# EAGLE design Enclosure 130x95 BPM-R (EAGLE 9.6.2)
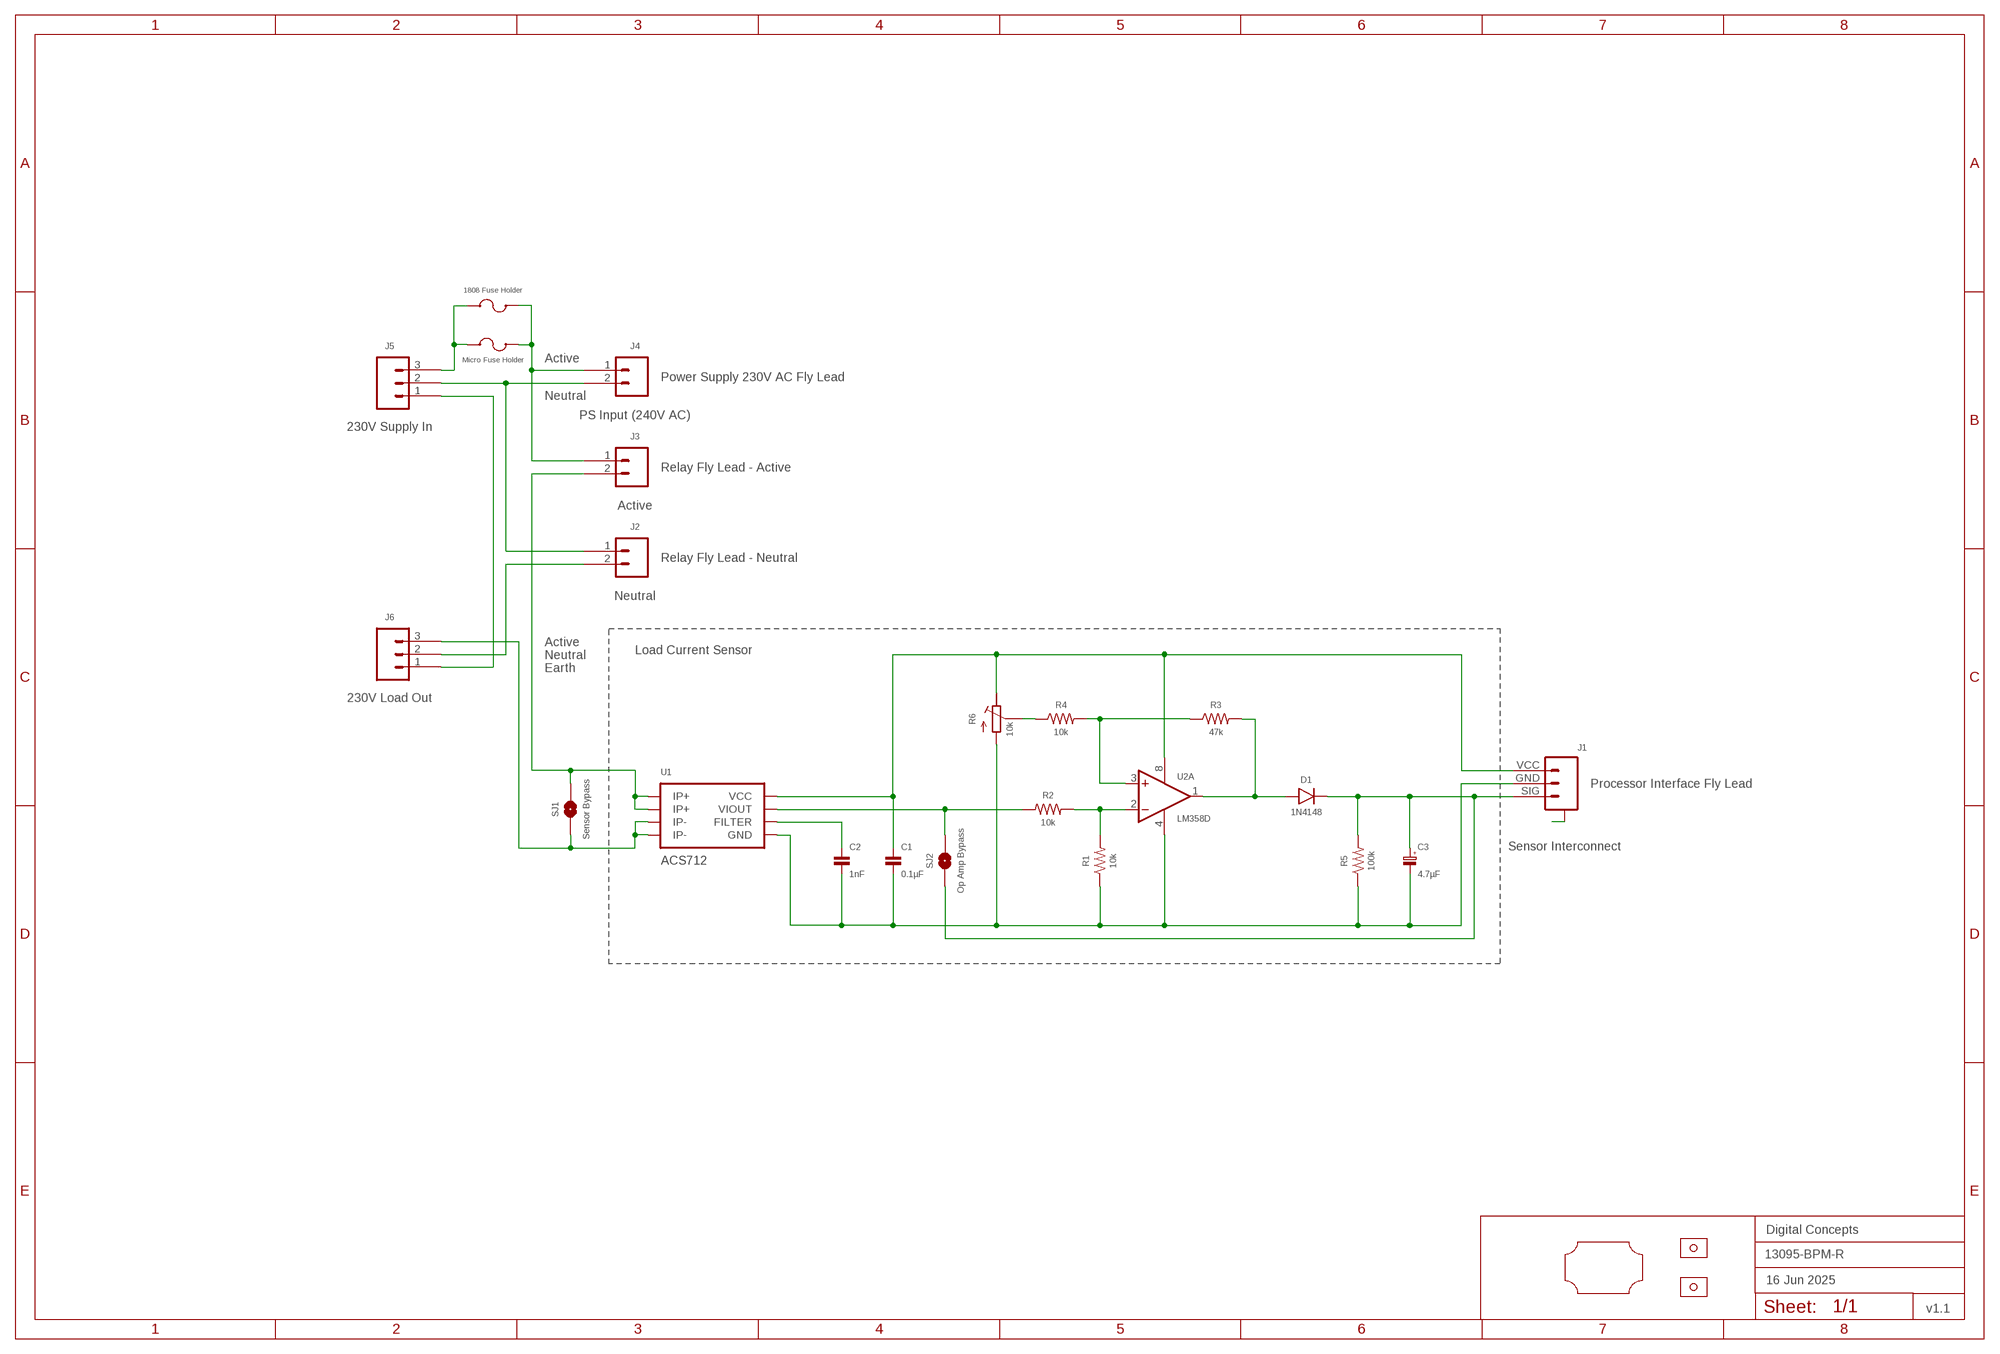
[diagram p0: schematic, sheet 1]
FRAME2 (A3L-LOC): DATE: 16 Jun 2025; OWNER: Digital Concepts; TITLE: 13095-BPM-R; VERSION: v1.1

## Parts
C1  0.1µF  CAPACITOR-0805  [C0805]
C2  1nF  CAPACITOR-0805  [C0805]
C3  4.7µF  CAPACITOR-1206-TANTALUM  [C1206-POLARISED]
D1  1N4148  DIODE-1N4148-SOD323  [SOD-323]
F2  1808 Fuse Holder  FUSE-HOLDER-1808  [FUSE-HOLDER-1808]
J1  Sensor Interconnect  JST-SH1.0-3-SMD-HORIZONTAL-SIG  [JST-SH1.0-3-HORIZONTAL-SIG]
J2  Neutral  TERMINAL_SCREW_2P_VERTICAL  [TERMINAL-SCREW-2P]
J3  Active  TERMINAL_SCREW_2P_VERTICAL  [TERMINAL-SCREW-2P]
J4  PS Input (240V AC)  JST-XH2.54-2-HORIZONTAL  [JST-XH2.4-2-HORIZONTAL]
J5  230V Supply In  TERMINAL_SCREW_3P_VERTICAL  [TERMINAL-SCREW-3P]
J6  230V Load Out  TERMINAL_SCREW_3P_VERTICAL  [TERMINAL-SCREW-3P]
R1  10k  RESISTORR0805  [R0805]
R2  10k  RESISTORR0805  [R0805]
R3  47k  RESISTORR0805  [R0805]
R4  10k  RESISTORR0805  [R0805]
R5  100k  RESISTORR0805  [R0805]
R6  10k  RESISTOR-TRIMM-3386P  [RTRIM3386P]
SJ1  Sensor Bypass  SJ  [SJ]
SJ2  Op Amp Bypass  SJ  [SJ]
U1  ACS712  [SOP-8]
U2  LM358D  [SOP-8]
U$1  PCB-OUTLINE-130X95-MAX-RC-H3  [PROTO-130X95-OUTLINE-MAX-RC-H3]
U$2  Micro Fuse Holder  FUSE-HOLDER  [FUSE-HOLDER-MICRO]
U$4  STRAIN-RELIEF-SADDLE  [STRAIN-RELIEF-SADDLE]
U$5  STRAIN-RELIEF-SADDLE  [STRAIN-RELIEF-SADDLE]

## Nets
A: J1.A@1(A) J1.A@3(A)
ACTIVE_IN: F2.P$2 J3.1 J4.1 U$2.P$3 U$2.P$4
ACTIVE_OUT: J3.2 SJ1.2 U1.1(IP+) U1.2(IP+)
EARTH: J5.1 J6.1
N$2: C1.1 J1.VCC R6.1(E) U1.8(VCC) U2.8(P:V+)
N$3: C3.1(+) D1.C J1.SIG R5.2 SJ2.1
N$4: D1.A R3.2 U2.1(A:OUT)
N$5: R3.1 R4.2 U2.3(A:+IN)
N$6: R4.1 R6.2(S)
N$7: F2.P$1 J5.3 U$2.P$1 U$2.P$2
N$8: R1.2 R2.2 U2.2(A:-IN)
N$19: J6.3 SJ1.1 U1.3(IP-) U1.4(IP-)
N$20: C1.2 C2.2 C3.2(-) J1.GND R1.1 R5.1 R6.3(A) U1.5(GND) U2.4(P:V-)
N$22: R2.1 SJ2.2 U1.7(VIOUT)
N$24: C2.1 U1.6(FILTER)
NEUTRAL_IN: J2.1 J4.2 J5.2
NEUTRAL_OUT: J2.2 J6.2
Unconnected: U2.5(B:+IN) U2.6(B:-IN) U2.7(B:OUT)

## Notes on the sheet
- Active
- Power Supply 230V AC Fly Lead
- Neutral
- Relay Fly Lead - Active
- Relay Fly Lead - Neutral
- Active
- Neutral | Load Current Sensor
- Earth
- Processor Interface Fly Lead

## Library data of the parts
C1 C2 = digitalconcepts:CAPACITOR-0805: 0805 Capacitor
C3 = digitalconcepts:CAPACITOR-1206-TANTALUM: Capacitor 1206 Tantalum
D1 = digitalconcepts:DIODE-1N4148-SOD323: 1N4148 SOD-323
F2 = digitalconcepts:FUSE-HOLDER-1808: 1808 Fuse Holder
J1 = digitalconcepts:JST-SH1.0-3-SMD-HORIZONTAL-SIG: JST SH1.0 3P SMD Horizontal Connector with Signal
J2 J3 = digitalconcepts:TERMINAL_SCREW_2P_VERTICAL: PCB Mount Screw-Type Terminal 2P
J4 = digitalconcepts:JST-XH2.54-2-HORIZONTAL: XH2.54 2P Horizontal Connector
J5 J6 = digitalconcepts:TERMINAL_SCREW_3P_VERTICAL: PCB Mount Screw-Type Terminal 3P
R1-R5 = digitalconcepts:RESISTOR: Resistor; SPICEPREFIX: R
R6 = digitalconcepts:RESISTOR-TRIMM-3386P: BOURNS Trim Pot 3386P
SJ1 SJ2 = digitalconcepts:SJ: Solder Jumper
U1 = digitalconcepts:ACS712: ACS712 Hall-Effect-Based Linear Current Sensor IC
U2 = digitalconcepts:LM358: OP AMP also LM158; LM258; LM2904 Source: http://cache.national.com/ds/LM/LM158.pdf
U$1 = digitalconcepts:PCB-OUTLINE-130X95-MAX-RC-H3: PCB Eagle Max-Right-Cropped outline for 130 x 95 enclosure (Horizontal format)
U$2 = digitalconcepts:FUSE-HOLDER: Fuse Holder
U$4 U$5 = digitalconcepts:STRAIN-RELIEF-SADDLE: Strain Relief Saddle (7mm x 13mm)

## Board
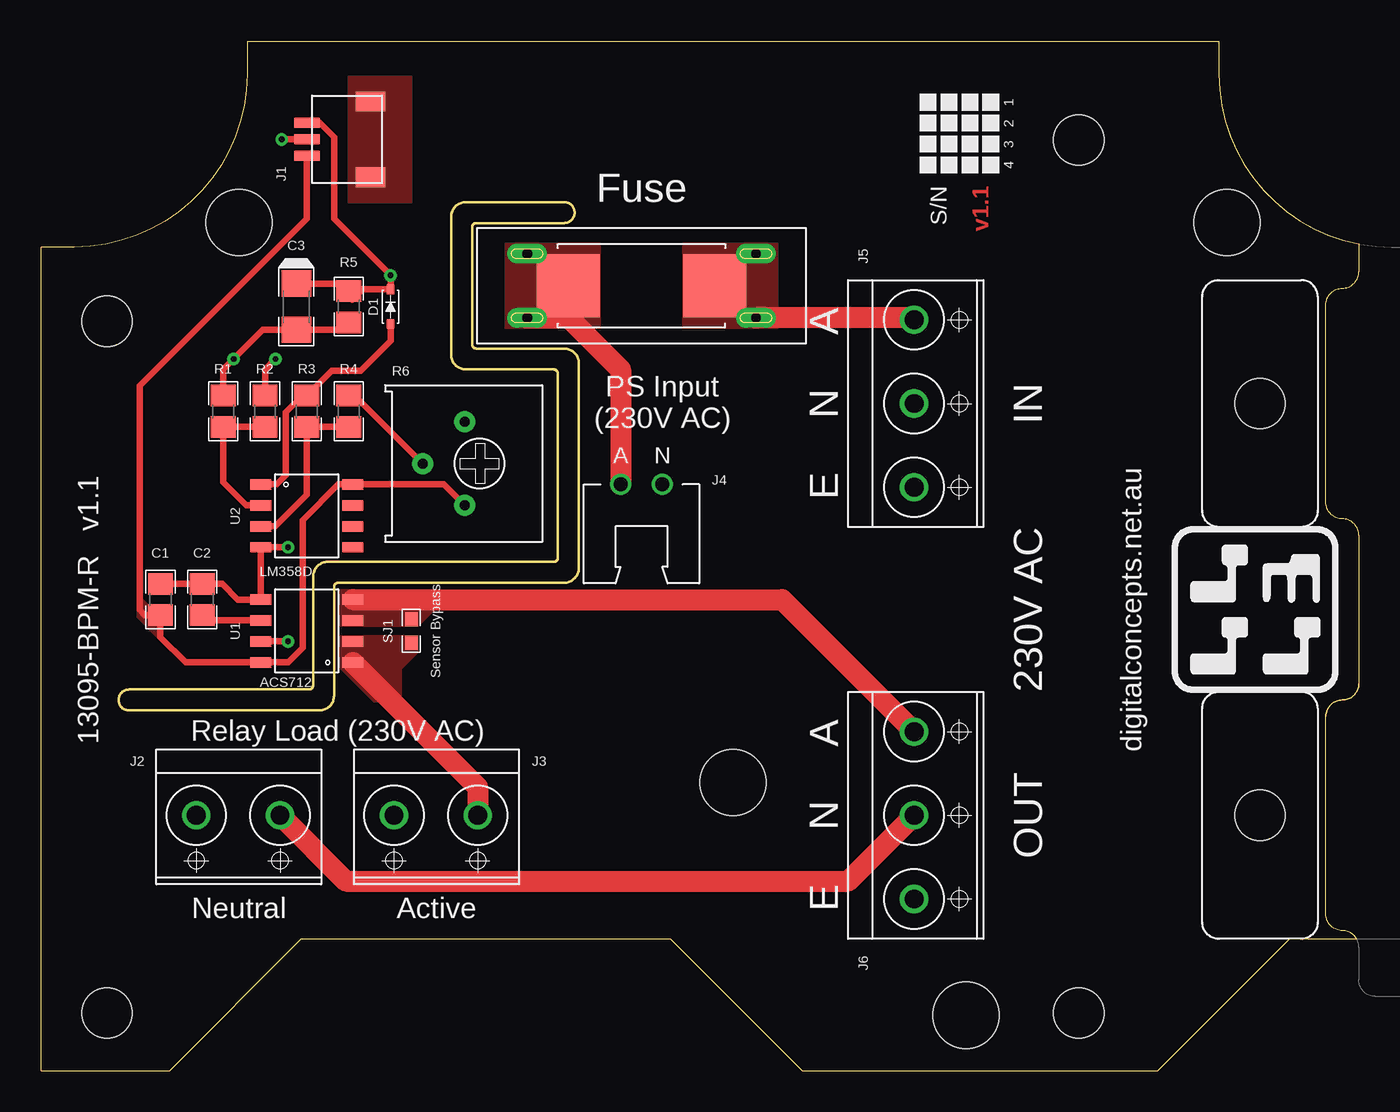
[diagram p1: board, top side]
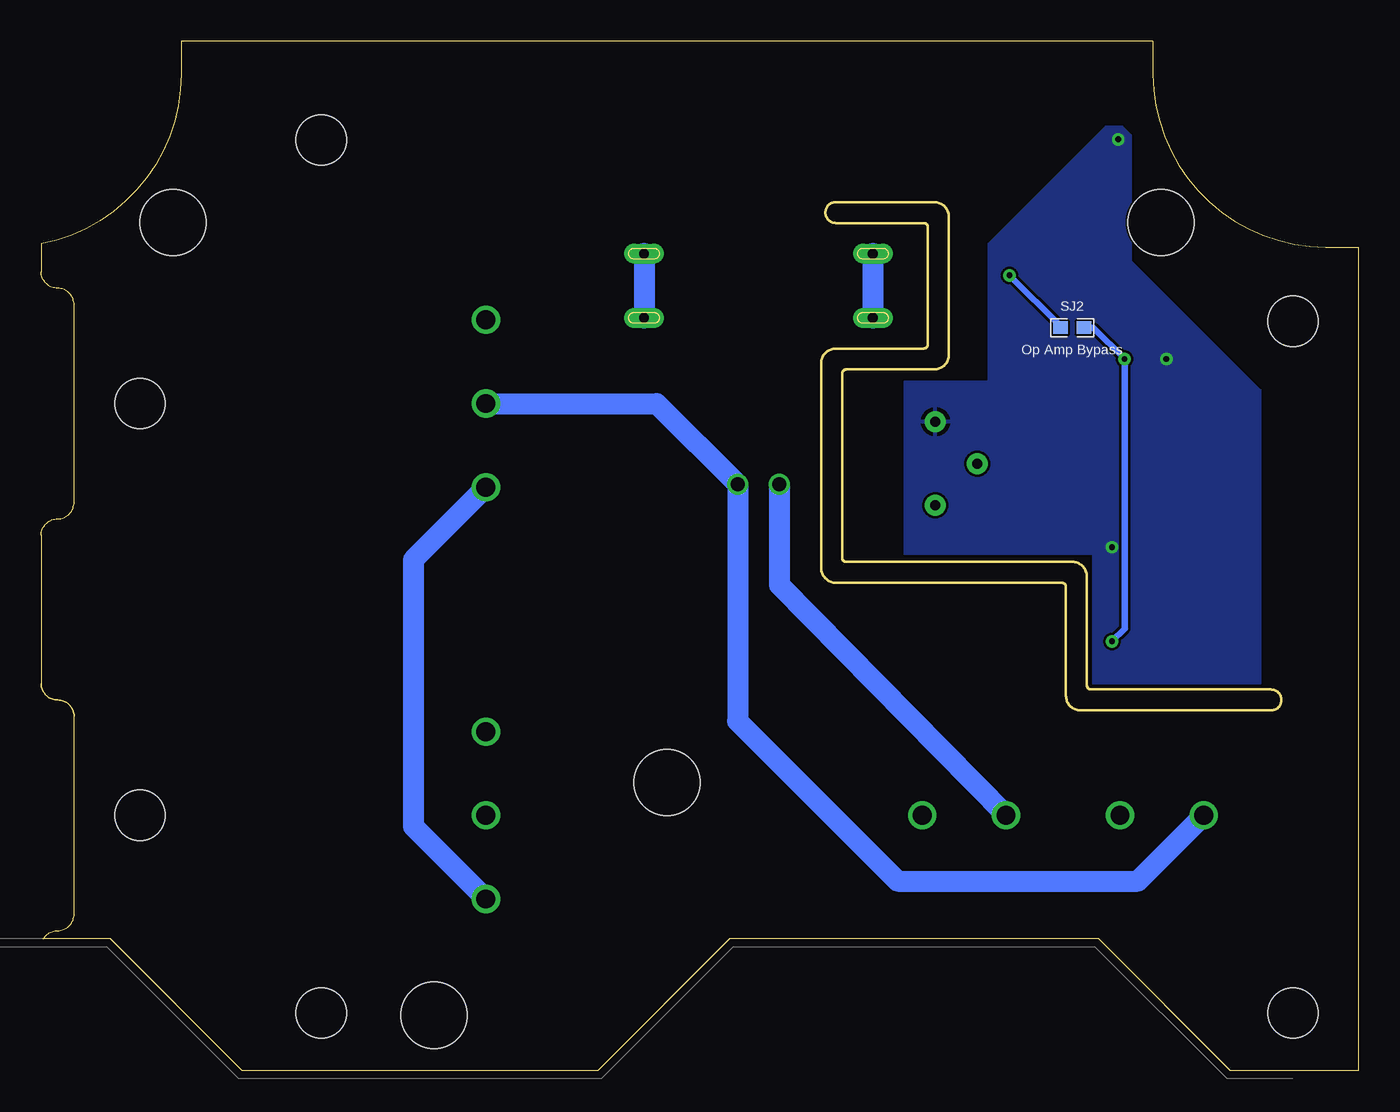
[diagram p2: board, bottom side, seen from below]

Size 80 x 62.5 mm. Coordinates in mm from the lower left corner, seen from the top.
Copper layers (1*16): Top 0.035mm / dielectric 1.5mm / Bottom 0.035mm
Design rules "default *": minimum track width 6mil, minimum drill 0.35mm, track to track 6mil, track to pad 6mil, pad to pad 6mil, via to via 6mil, smd to smd 6mil, copper to edge 6mil, drill to drill 6mil, minimum pad ring 1mil, minimum via ring 8mil, stop-mask expansion 4mil, vias tented up to drill 0mil, thermal gap 10mil
Milling: 28 lines

### Footprints (pad centres in the part's own frame; a part is rotated, then mirrored left to right if it is on the bottom)
C0805 = smd 1.3 x 1.5: 1 -0.95,0; 2 0.95,0
C1206-POLARISED = smd 1.6 x 1.8: 1 -1.4,0; 2 1.4,0
SOD-323 = smd 0.59 x 0.45: A -1.055,0; C 1.055,0
FUSE-HOLDER-1808 = smd 3.81 x 3.81: P$1 -4.445,0; P$2 4.445,0
JST-SH1.0-3-HORIZONTAL-SIG = smd 1.2 x 1.8: A@1 -2.3,-1.335; A@3 2.3,-1.335 | smd 0.6 x 1.55: GND 0,2.54; SIG 1,2.54; VCC -1,2.54
TERMINAL-SCREW-2P = drill 1.143: 1 -2.58,0; 2 2.5,0
JST-XH2.4-2-HORIZONTAL = drill 0.85: 1 1.27,0; 2 -1.27,0
TERMINAL-SCREW-3P = drill 1.143: 1 -5.08,0; 2 0,0; 3 5.08,0
R0805 = smd 1.3 x 1.5: 1 -0.95,0; 2 0.95,0
RTRIM3386P = drill 0.61 pad 1.27: 1 2.54,0.05; 2 0,-2.5; 3 -2.54,0.05
SJ = smd 0.864 x 0.762: 1 -0.711,0; 2 0.711,0
SOP-8 = smd 0.635 x 1.27: 1 -1.905,-2.794; 2 -0.635,-2.794; 3 0.635,-2.794; 4 1.905,-2.794; 5 1.905,2.794; 6 0.635,2.794; 7 -0.635,2.794; 8 -1.905,2.794
PROTO-130X95-OUTLINE-MAX-RC-H3 = hole 3.048: -38,10; 21,21; 21,-32; -38,-32 | hole 4: 0,-18; -30,16; 30,16; 14.14,-32.14
FUSE-HOLDER-MICRO = drill 0.6 pad 1.2 long: P$1 -6.95,1.95; P$2 -6.95,-1.95; P$3 6.95,-1.95; P$4 6.95,1.95
STRAIN-RELIEF-SADDLE = hole 3.048: 0,0

### Placement (x,y rotation side)
C1  7.24,28.6 90 top
C2  9.78,28.6 90 top
C3  15.5,46.38 270 top
D1  21.21,46.38 90 top
F2  36.45,47.65 180 top
J1  18.67,56.54 90 top
J2  12,15.5 0 top
J3  24,15.5 0 top
J4  36.45,35.59 180 top
J5  53,40.5 90 top
J6  53,15.5 90 top
R1  11.05,40.03 270 top
R2  13.59,40.03 270 top
R3  16.13,40.03 90 top
R4  18.67,40.03 270 top
R5  18.67,46.38 90 top
R6  25.66,36.85 270 top
SJ1  22.48,26.7 270 top
SJ2  17.4,45.11 0 bottom
U1  16.13,26.7 90 top
U2  16.13,33.68 270 top
U$1  42,35.5 0 top
U$2  36.45,47.65 180 top
U$4  74,40.5 90 top
U$5  74,15.5 90 top

### Tracks (layer width: path | path; a pad name or v marks a point on that pad's centre or on a via)
A
  pour Top (no thermals): 18.67,60.35 22.48,60.35 22.48,52.73 18.67,52.73
ACTIVE_IN
  Top 1.27: U$2.P$4 32.04,45.7 35.18,42.56 J4.1
  Bottom 1.27: J4.1 35.18,29.49 J3.1 | U$2.P$3 U$2.P$4
  pour Top (no thermals): 28.2,50.19 33.91,50.19 33.91,45.11 28.2,45.11
ACTIVE_OUT
  Top 1.27: J3.2 26.5,17.21 U1.1
  pour Top (no thermals): 18.04,26.44 22.86,26.44 22.86,25.36 21.86,24.36 21.86,22.37 20.22,22.37 18.04,24.55
EARTH
  Bottom 1.27: J5.1 57.41,31.02 57.41,14.82 J6.1
N$2
  Top 0.406: R6.1 24.44,35.59 U2.8 18.04,35.59 15.88,33.43 15.88,25.68 14.99,24.79 U1.8 8.76,24.79 7.24,26.31 C1.1 6.29,27.65 5.97,27.97 5.97,41.57 16.13,51.73 J1.VCC
  pour Top (no thermals): 7.24,26.31 7.24,27.97 6.61,27.97 5.97,28.6 5.97,27.58
N$3  (via drill 0.35)
  Top 0.406: C3.1 18.22,47.78 R5.2 18.88,47.12 18.88,46.8 19.52,47.44 D1.C v21.21,48.28 17.78,51.71 17.78,56.67 16.91,57.54 J1.SIG
  Bottom 0.406: SJ2.1 18.11,45.19 v21.21,48.28
N$4
  Top 0.406: U2.1 14.29,35.59 14.86,36.15 14.86,39.96 15.88,40.98 R3.2 17.65,42.5 19.41,42.5 21.21,44.31 D1.A
N$5
  Top 0.406: U2.3 14.23,33.05 16.13,34.95 R3.1 R4.2
N$6
  Top 0.406: R6.2 19.03,40.98 R4.1
N$7
  Top 1.27: U$2.P$1 52.88,45.7 J5.3
  Bottom 1.27: U$2.P$2 U$2.P$1
  pour Top (no thermals): 38.99,50.19 44.7,50.19 44.7,45.11 38.99,45.11
N$8
  Top 0.406: U2.2 12.45,34.31 11.05,35.71 R1.2 R2.2
N$19
  Top 1.27: J6.3 44.98,28.6 U1.4
  pour Top (no thermals): 18.04,29.23 23.75,29.23 24.38,28.6 24.38,28.47 22.86,26.95 18.04,26.95
N$20  (via drill 0.35)
  Top 0.406: C1.2 C2.2 10.99,29.55 11.94,28.6 U1.5 13.33,31.58 U2.4 v14.99,31.77 | R5.1 18.22,44.98 C3.2 13.46,44.98 v11.68,43.2 11.05,42.57 R1.1 | J1.GND v14.61,56.54
  pour Bottom: 15.37,57.3 14.35,57.3 13.84,56.79 13.84,49.17 5.97,41.3 5.97,23.52 16.13,23.52 16.13,31.39 27.56,31.39 27.56,41.81 22.48,41.81 22.48,50.19
N$22  (via drill 0.35)
  Top 0.406: v14.23,43.2 13.59,42.57 R2.1 | v14.99,26.06 U1.7
  Bottom 0.406: v14.99,26.06 14.23,26.82 v14.23,43.2 16.13,45.11 SJ2.2
N$24
  Top 0.406: U1.6 10.1,27.33 C2.1
NEUTRAL_IN
  Bottom 1.27: J5.2 42.63,40.5 J4.2 37.72,21.22 28,11.5 13.42,11.5 J2.1
NEUTRAL_OUT
  Top 1.27: J2.2 18.5,11.5 49,11.5 J6.2

### Text on the board
Top: v1.1
tPlace: 1 | 2 | 3 | 4 | S/N | 13095-BPM-R v1.1 | digitalconcepts.net.au
tNames: Fuse | A | N | IN | PS Input / (230V AC) | A | N | E | 230V AC | Relay Load (230V AC) | A | N | OUT | E